# Altium project gateway-linux-cm4.PrjPcb
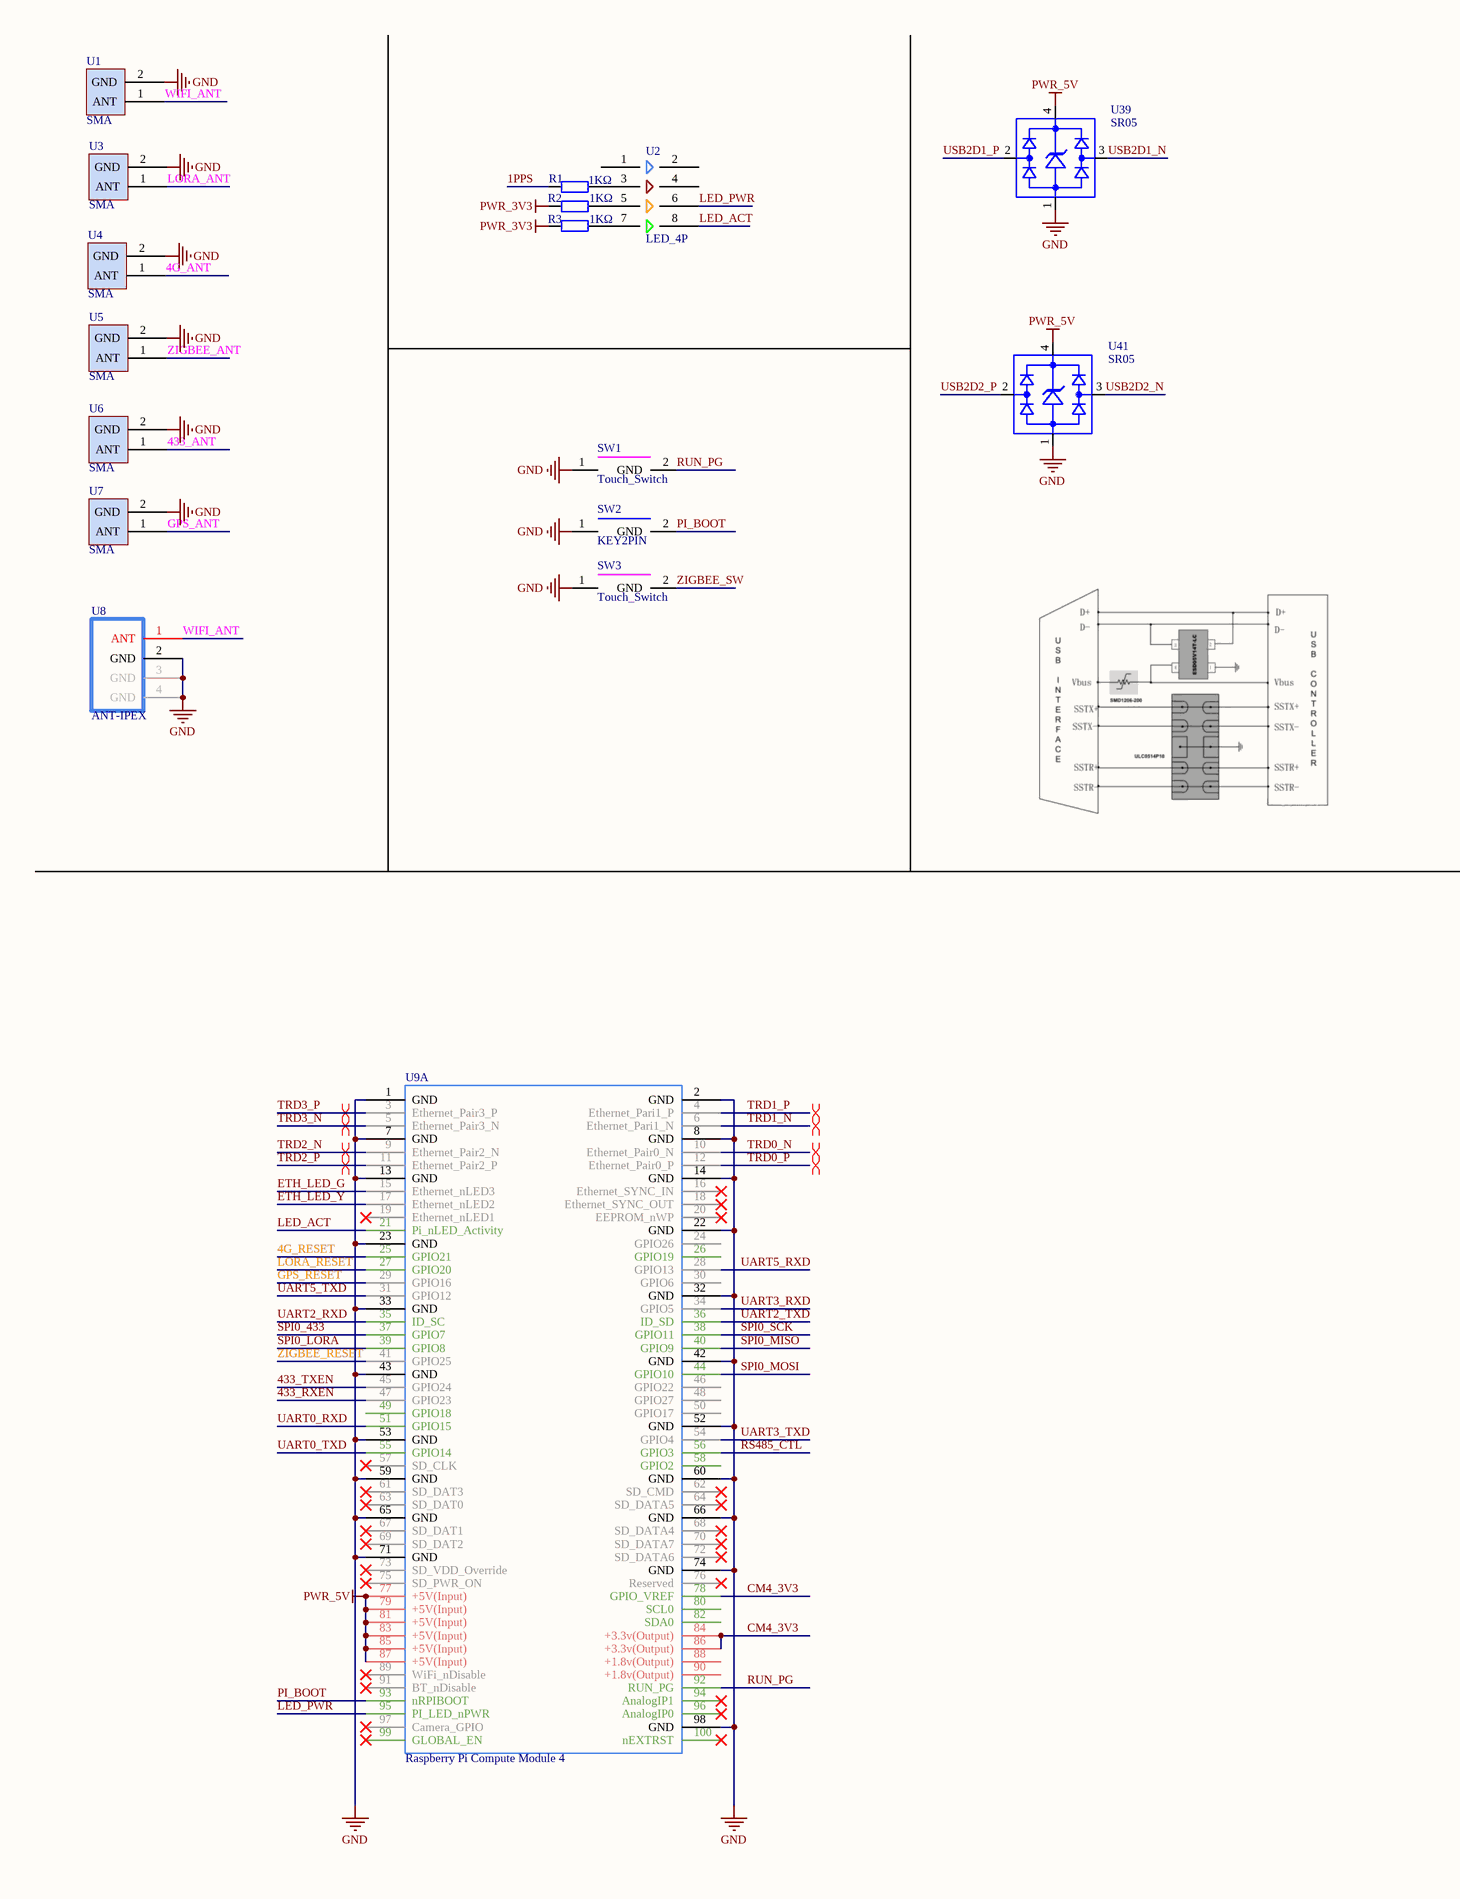
[diagram p0: G1-CM4.SchDoc, left]
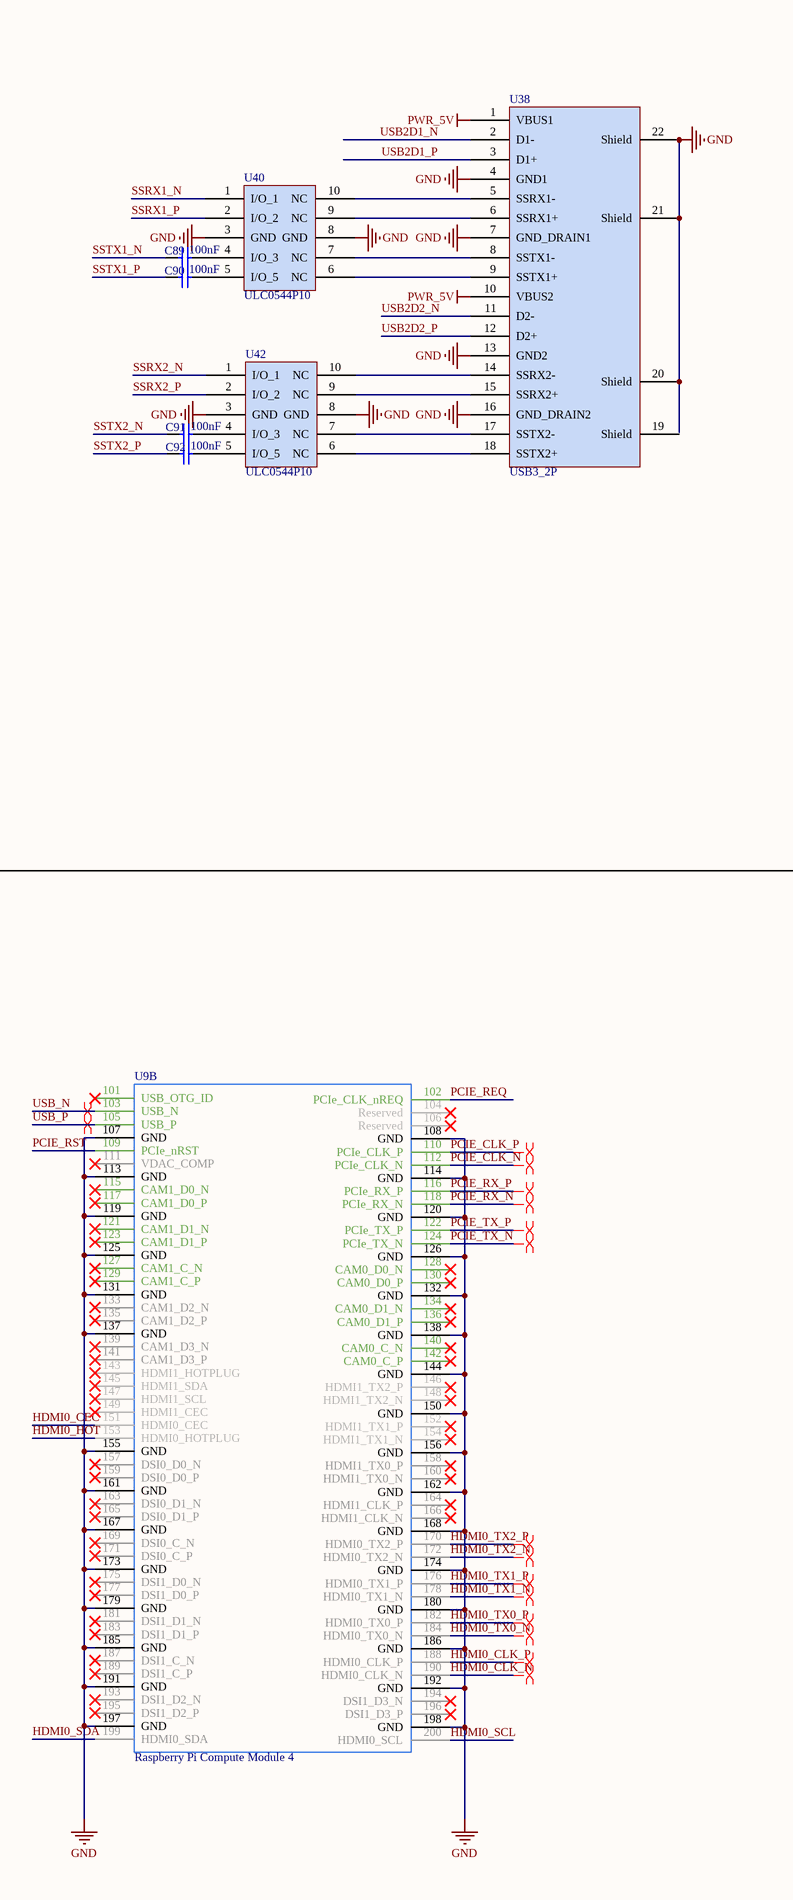
[diagram p1: G1-CM4.SchDoc, right]
3 sheets, 213 parts. Net scope: global (net labels, ports and power ports of the same name join across sheets).
Board file: G1.PcbDoc
Sheets:
  G1-CM4.SchDoc
  G2-PMS.SchDoc
  G3-Sensor.SchDoc

## Sheet G1-CM4.SchDoc
size A2; SheetNumber: 1; SheetTotal: 3

### Parts
C89  100nF  [0402_C]
C90  100nF  [0402_C]
C91  100nF  [0402_C]
C92  100nF  [0402_C]
R1  1KΩ  [0402_R]
R2  1KΩ  [0402_R]
R3  1KΩ  [0402_R]
SW1  Touch_Switch  [Touch_Switch]
SW2  KEY2PIN  [KEY2PIN]
SW3  Touch_Switch  [Touch_Switch]
U1  SMA  [SMA]
U2  LED_4P  [LED_4P]
U3  SMA  [SMA]
U4  SMA  [SMA]
U5  SMA  [SMA]
U6  SMA  [SMA]
U7  SMA  [SMA]
U8  ANT-IPEX  [ANT-IPEX]
U9  Raspberry Pi Compute Module 4  [CM4T-DF40HC(3.0)-100DS]  (parts A,B of 2)
U38  USB3_2P  [USB3_2P]
U39  SR05  [SR05]
U40  ULC0544P10  [ULC0544P10]
U41  SR05  [SR05]
U42  ULC0544P10  [ULC0544P10]

### Nets
GND: SW1.1 SW2.1 SW3.1 U1.2(GND) U3.2(GND) U4.2(GND) U5.2(GND) U6.2(GND) U7.2(GND) U8.2(GND) U8.3(GND) U8.4(GND) U9.1(GND) U9.2(GND) U9.7(GND) U9.8(GND) U9.13(GND) U9.14(GND) U9.22(GND) U9.23(GND) U9.32(GND) U9.33(GND) U9.42(GND) U9.43(GND) U9.52(GND) U9.53(GND) U9.59(GND) U9.60(GND) U9.65(GND) U9.66(GND) U9.71(GND) U9.74(GND) U9.98(GND) U9.107(GND) U9.108(GND) U9.113(GND) U9.114(GND) U9.119(GND) U9.120(GND) U9.125(GND) U9.126(GND) U9.131(GND) U9.132(GND) U9.137(GND) U9.138(GND) U9.144(GND) U9.150(GND) U9.155(GND) U9.156(GND) U9.161(GND) U9.162(GND) U9.167(GND) U9.168(GND) U9.173(GND) U9.174(GND) U9.179(GND) U9.180(GND) U9.185(GND) U9.186(GND) U9.191(GND) U9.192(GND) U9.197(GND) U9.198(GND) U38.4(GND1) U38.7(GND_DRAIN1) U38.13(GND2) U38.16(GND_DRAIN2) U38.20(Shield) U38.21(Shield) U38.22(Shield) U39.1 U40.3(GND) U40.8(GND) U41.1 U42.3(GND) U42.8(GND)
PWR_3V3: R2.1 R3.1
PWR_5V: U9.77(+5V(Input)) U9.79(+5V(Input)) U9.81(+5V(Input)) U9.83(+5V(Input)) U9.85(+5V(Input)) U9.87(+5V(Input)) U38.1(VBUS1) U38.10(VBUS2) U39.4 U41.4
1PPS: R1.1
4G_ANT: U4.1(ANT)
4G_RESET: U9.25(GPIO21)
433_ANT: U6.1(ANT)
433_RXEN: U9.47(GPIO23)
433_TXEN: U9.45(GPIO24)
CM4_3V3: U9.78(GPIO_VREF) U9.84(+3.3v(Output)) U9.86(+3.3v(Output))
ETH_LED_G: U9.15(Ethernet_nLED3)
ETH_LED_Y: U9.17(Ethernet_nLED2)
GPS_ANT: U7.1(ANT)
GPS_RESET: U9.29(GPIO16)
HDMI0_CEC: U9.151(HDMI0_CEC)
HDMI0_CLK_N: U9.190(HDMI0_CLK_N)
HDMI0_CLK_P: U9.188(HDMI0_CLK_P)
HDMI0_HOT: U9.153(HDMI0_HOTPLUG)
HDMI0_SCL: U9.200(HDMI0_SCL)
HDMI0_SDA: U9.199(HDMI0_SDA)
HDMI0_TX0_N: U9.184(HDMI0_TX0_N)
HDMI0_TX0_P: U9.182(HDMI0_TX0_P)
HDMI0_TX1_N: U9.178(HDMI0_TX1_N)
HDMI0_TX1_P: U9.176(HDMI0_TX1_P)
HDMI0_TX2_N: U9.172(HDMI0_TX2_N)
HDMI0_TX2_P: U9.170(HDMI0_TX2_P)
LED_ACT: U2.8 U9.21(Pi_nLED_Activity)
LED_PWR: U2.6 U9.95(PI_LED_nPWR)
LORA_ANT: U3.1(ANT)
LORA_RESET: U9.27(GPIO20)
PCIE_CLK_N: U9.112(PCIe_CLK_N)
PCIE_CLK_P: U9.110(PCIe_CLK_P)
PCIE_REQ: U9.102(PCIe_CLK_nREQ)
PCIE_RST: U9.109(PCIe_nRST)
PCIE_RX_N: U9.118(PCIe_RX_N)
PCIE_RX_P: U9.116(PCIe_RX_P)
PCIE_TX_N: U9.124(PCIe_TX_N)
PCIE_TX_P: U9.122(PCIe_TX_P)
PI_BOOT: SW2.2(GND) U9.93(nRPIBOOT)
RS485_CTL: U9.56(GPIO3)
RUN_PG: SW1.2(GND) U9.92(RUN_PG)
SPI0_433: U9.37(GPIO7)
SPI0_LORA: U9.39(GPIO8)
SPI0_MISO: U9.40(GPIO9)
SPI0_MOSI: U9.44(GPIO10)
SPI0_SCK: U9.38(GPIO11)
SSRX1_N: U40.1(I/O_1)
SSRX1_P: U40.2(I/O_2)
SSRX2_N: U42.1(I/O_1)
SSRX2_P: U42.2(I/O_2)
SSTX1_N: C89.1
SSTX1_P: C90.1
SSTX2_N: C91.1
SSTX2_P: C92.1
TRD0_N: U9.10(Ethernet_Pair0_N)
TRD0_P: U9.12(Ethernet_Pair0_P)
TRD1_N: U9.6(Ethernet_Pari1_N)
TRD1_P: U9.4(Ethernet_Pari1_P)
TRD2_N: U9.9(Ethernet_Pair2_N)
TRD2_P: U9.11(Ethernet_Pair2_P)
TRD3_N: U9.5(Ethernet_Pair3_N)
TRD3_P: U9.3(Ethernet_Pair3_P)
UART0_RXD: U9.51(GPIO15)
UART0_TXD: U9.55(GPIO14)
UART2_RXD: U9.35(ID_SC)
UART2_TXD: U9.36(ID_SD)
UART3_RXD: U9.34(GPIO5)
UART3_TXD: U9.54(GPIO4)
UART5_RXD: U9.28(GPIO13)
UART5_TXD: U9.31(GPIO12)
USB2D1_N: U38.2(D1-) U39.3
USB2D1_P: U38.3(D1+) U39.2
USB2D2_N: U38.11(D2-) U41.3
USB2D2_P: U38.12(D2+) U41.2
USB_N: U9.103(USB_N)
USB_P: U9.105(USB_P)
WIFI_ANT: U1.1(ANT) U8.1(ANT)
ZIGBEE_ANT: U5.1(ANT)
ZIGBEE_RESET: U9.41(GPIO25)
ZIGBEE_SW: SW3.2(GND)
NetC89_2: C89.2 U40.4(I/O_3)
NetC90_2: C90.2 U40.5(I/O_5)
NetC91_2: C91.2 U42.4(I/O_3)
NetC92_2: C92.2 U42.5(I/O_5)
NetR1_2: R1.2 U2.3
NetR2_2: R2.2 U2.5
NetR3_2: R3.2 U2.7
NetU38_5: U38.5(SSRX1-) U40.10(NC)
NetU38_6: U38.6(SSRX1+) U40.9(NC)
NetU38_8: U38.8(SSTX1-) U40.7(NC)
NetU38_9: U38.9(SSTX1+) U40.6(NC)
NetU38_14: U38.14(SSRX2-) U42.10(NC)
NetU38_15: U38.15(SSRX2+) U42.9(NC)
NetU38_17: U38.17(SSTX2-) U42.7(NC)
NetU38_18: U38.18(SSTX2+) U42.6(NC)

Not connected (* = marked no-connect by the designer): U2 1 2 4; U9 16(Ethernet_SYNC_IN)* 18(Ethernet_SYNC_OUT)* 19(Ethernet_nLED1)* 20(EEPROM_nWP)* 24(GPIO26) 26(GPIO19) 30(GPIO6) 46(GPIO22) 48(GPIO27) 49(GPIO18) 50(GPIO17) 57(SD_CLK)* 58(GPIO2) 61(SD_DAT3)* 62(SD_CMD)* 63(SD_DAT0)* 64(SD_DATA5)* 67(SD_DAT1)* 68(SD_DATA4)* 69(SD_DAT2)* 70(SD_DATA7)* 72(SD_DATA6)* 73(SD_VDD_Override)* 75(SD_PWR_ON)* 76(Reserved)* 80(SCL0) 82(SDA0) 88(+1.8v(Output)) 89(WiFi_nDisable)* 90(+1.8v(Output)) 91(BT_nDisable)* 94(AnalogIP1)* 96(AnalogIP0)* 97(Camera_GPIO)* 99(GLOBAL_EN)* 100(nEXTRST)* 101(USB_OTG_ID)* 104(Reserved)* 106(Reserved)* 111(VDAC_COMP)* 115(CAM1_D0_N)* 117(CAM1_D0_P)* 121(CAM1_D1_N)* 123(CAM1_D1_P)* 127(CAM1_C_N)* 128(CAM0_D0_N)* 129(CAM1_C_P)* 130(CAM0_D0_P)* 133(CAM1_D2_N)* 134(CAM0_D1_N)* 135(CAM1_D2_P)* 136(CAM0_D1_P)* 139(CAM1_D3_N)* 140(CAM0_C_N)* 141(CAM1_D3_P)* 142(CAM0_C_P)* 143(HDMI1_HOTPLUG)* 145(HDMI1_SDA)* 146(HDMI1_TX2_P)* 147(HDMI1_SCL)* 148(HDMI1_TX2_N)* 149(HDMI1_CEC)* 152(HDMI1_TX1_P)* 154(HDMI1_TX1_N)* 157(DSI0_D0_N)* 158(HDMI1_TX0_P)* 159(DSI0_D0_P)* 160(HDMI1_TX0_N)* 163(DSI0_D1_N)* 164(HDMI1_CLK_P)* 165(DSI0_D1_P)* 166(HDMI1_CLK_N)* 169(DSI0_C_N)* 171(DSI0_C_P)* 175(DSI1_D0_N)* 177(DSI1_D0_P)* 181(DSI1_D1_N)* 183(DSI1_D1_P)* 187(DSI1_C_N)* 189(DSI1_C_P)* 193(DSI1_D2_N)* 194(DSI1_D3_N)* 195(DSI1_D2_P)* 196(DSI1_D3_P)*; U38 19(Shield)

### Layout directives
differential pair: HDMI0_CLK_N, HDMI0_CLK_P, HDMI0_TX0_N, HDMI0_TX0_P, HDMI0_TX1_N, HDMI0_TX1_P, HDMI0_TX2_N, HDMI0_TX2_P, PCIE_CLK_N, PCIE_CLK_P, PCIE_RX_N, PCIE_RX_P, PCIE_TX_N, PCIE_TX_P, TRD0_N, TRD0_P, TRD1_N, TRD1_P, TRD2_N, TRD2_P, TRD3_N, TRD3_P, USB_N, USB_P

### Library data of the parts
C89-C92 = 0402 100nF (104) 10% 16V: 贴片电容; ComponentLink1Description: 供应商链接; ComponentLink1URL: http://www.szlcsc.com/product/details_1877.html; Package: 0402; Supplier: LC; SuppliersPartNumber: C1525
R1-R3 = 0402 1KΩ (1001) 1%: 贴片电阻; ComponentLink1Description: 供应商链接; ComponentLink1URL: http://www.szlcsc.com/product/details_12256.html; Package: 0402; Supplier: LC; SuppliersPartNumber: C11702
SW1 SW3 = Touch_Switch: Touch_Switch 2PIN
SW2 = KEY2PIN: Switch Button
U1 U3-U7 = SMA: SMA ANT
U2 = LED_4P: LED
U8 = ANT-IPEX: ANT
U9 = CM4
U38 = USB3_2P: USB3.0 2Ports
U40 U42 = ULC0544P10: ESD

## Sheet G2-PMS.SchDoc
size A2; SheetNumber: 2; SheetTotal: 3
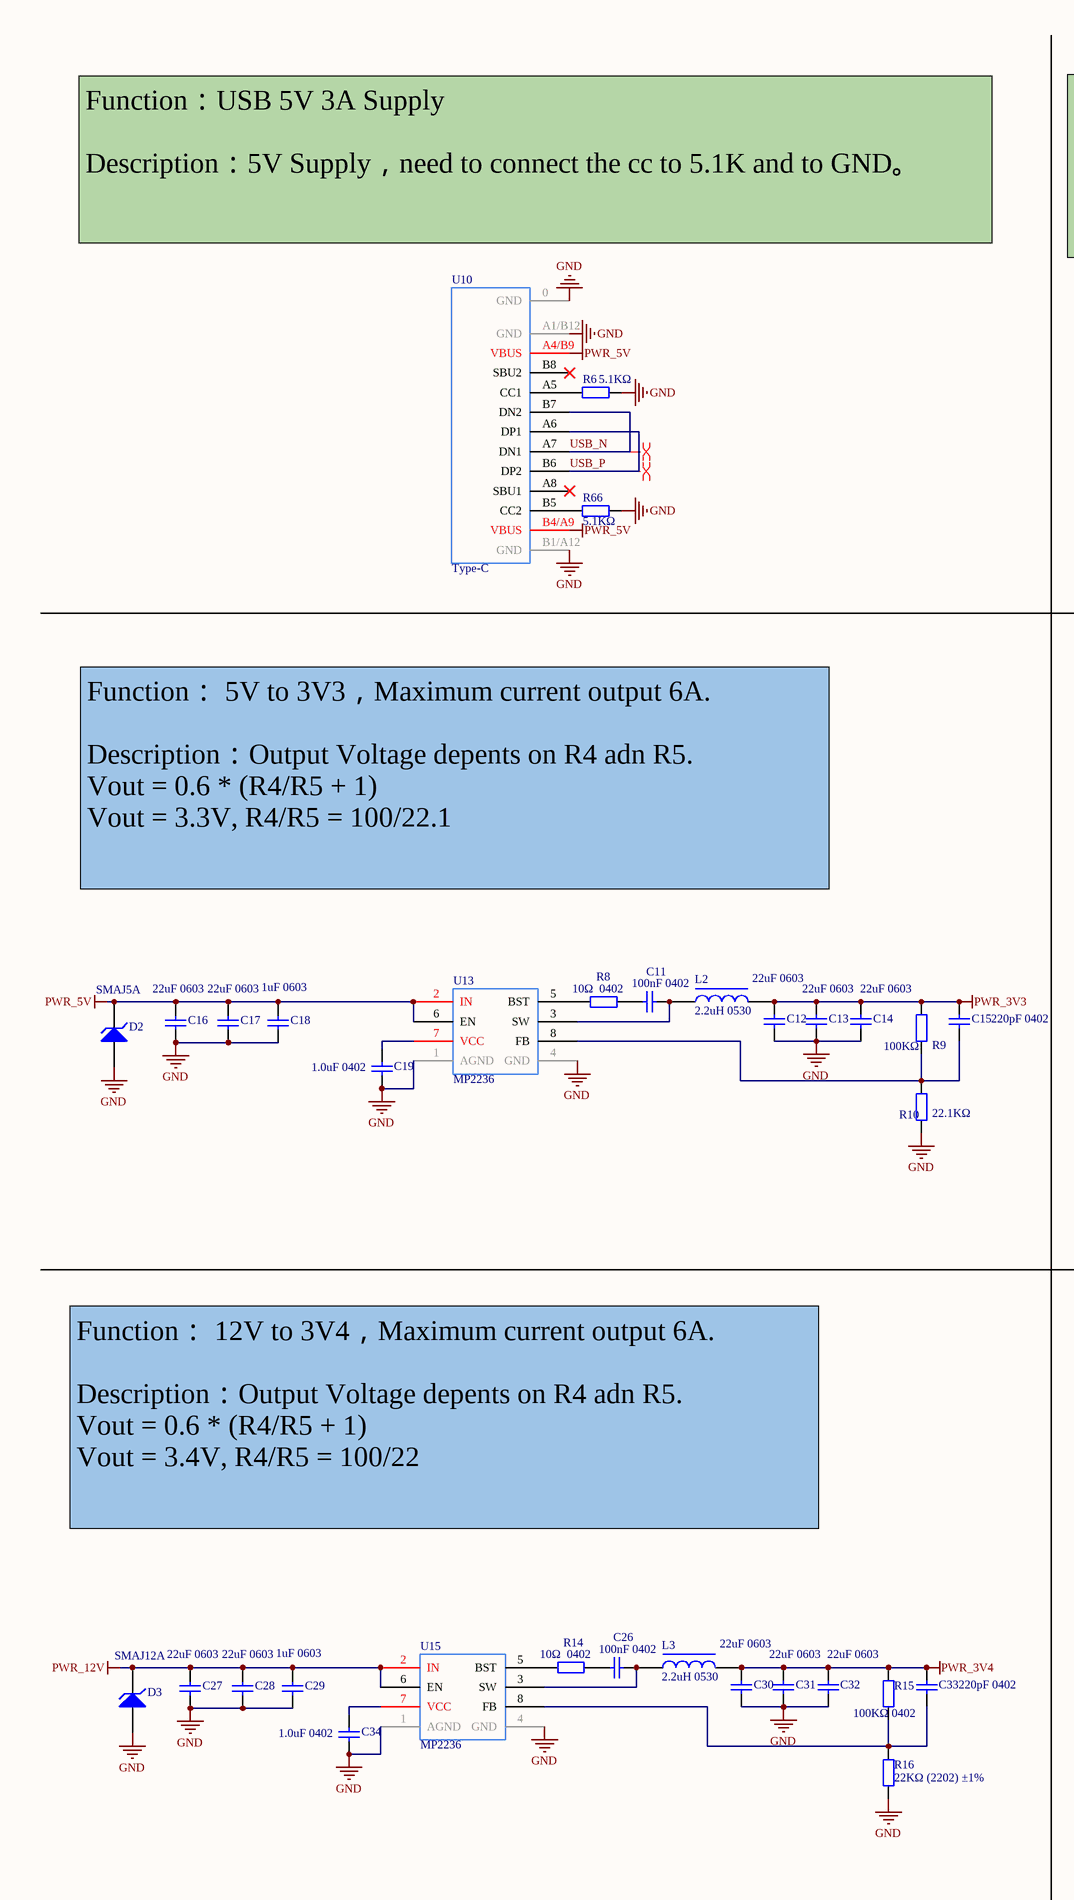
[diagram p2: G2-PMS.SchDoc, left]
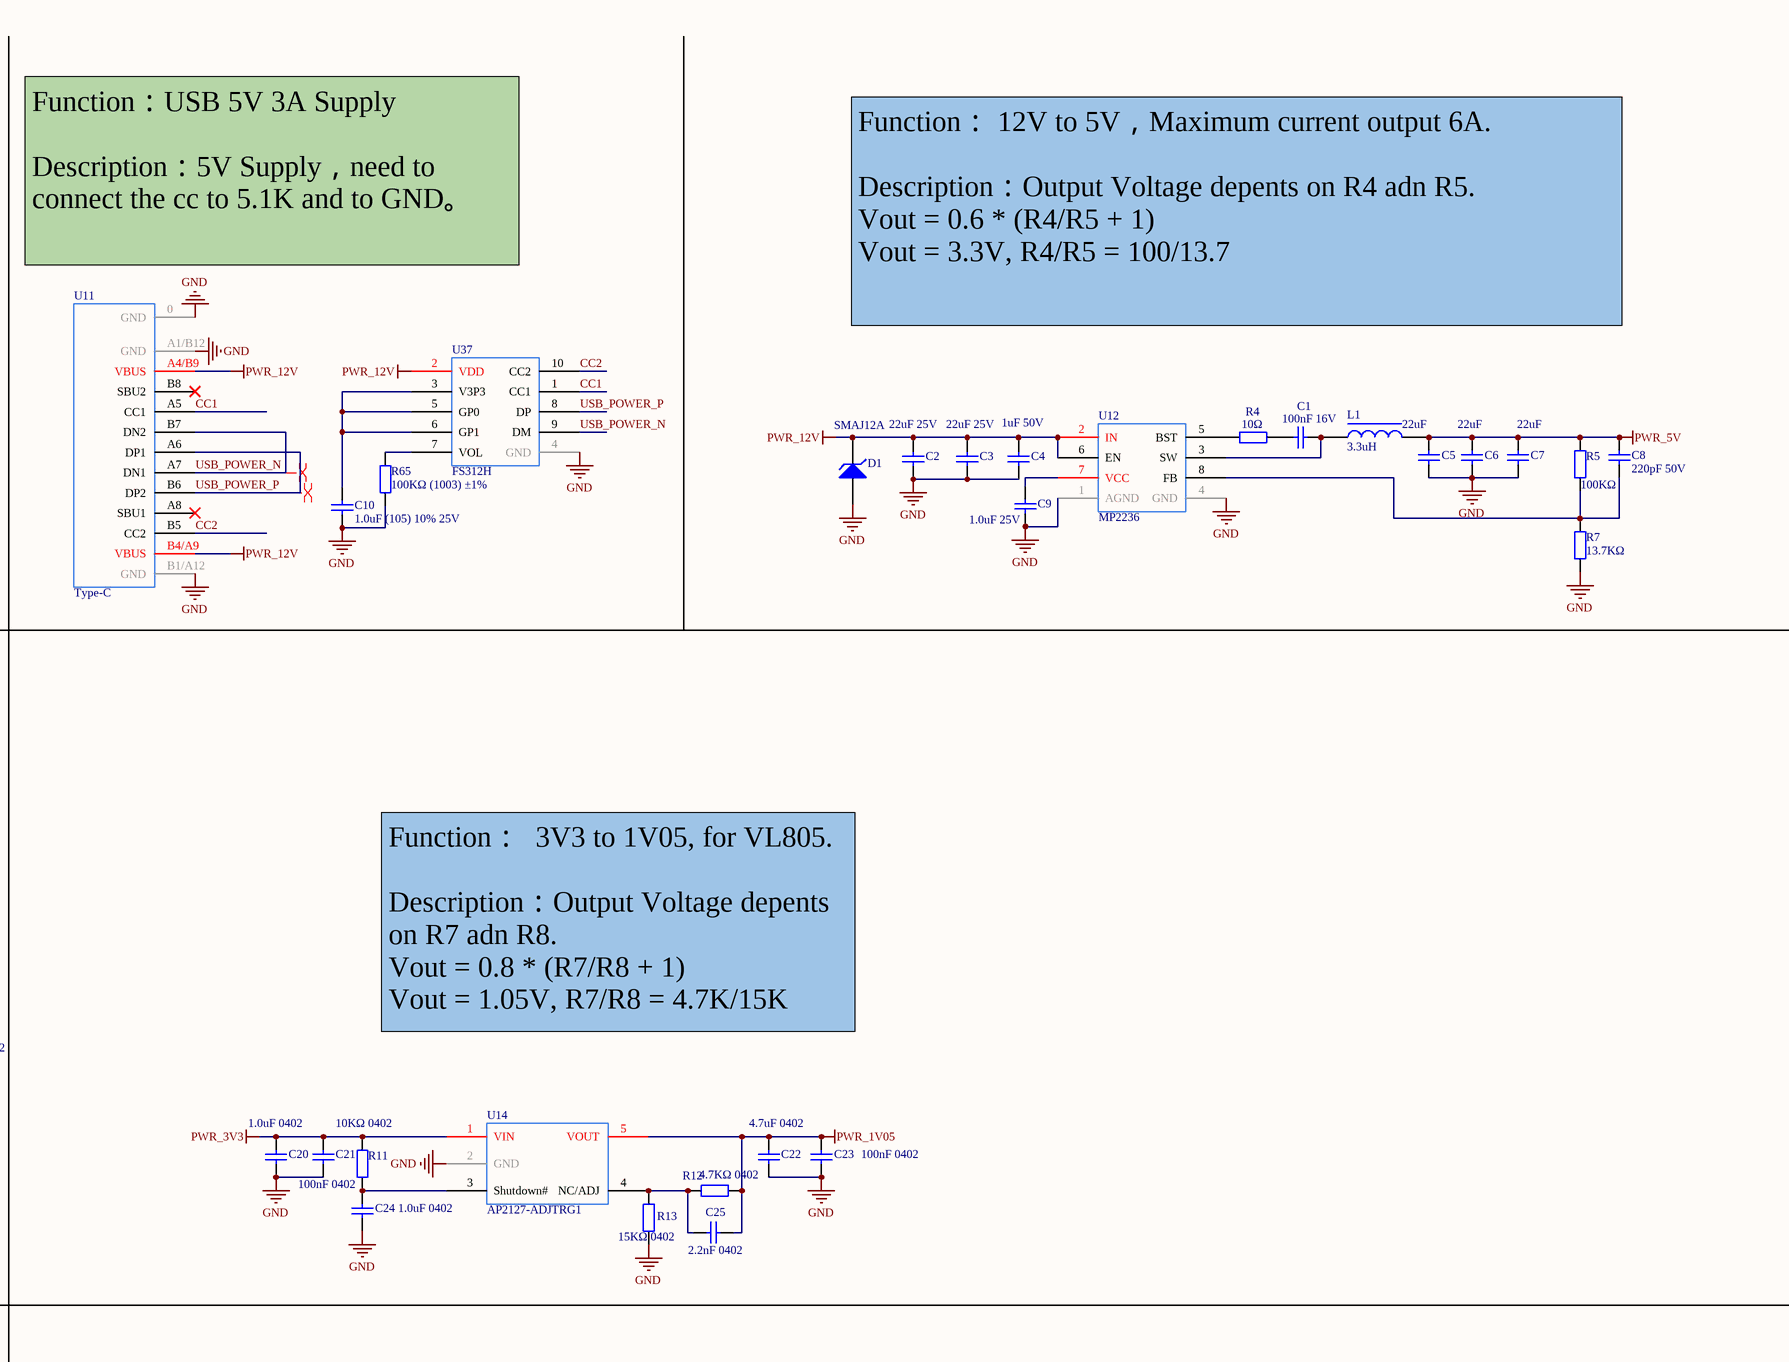
[diagram p3: G2-PMS.SchDoc, right]

### Parts
C1  100nF 16V  [0402_C]
C2  22uF 25V  [0805_C]
C3  22uF 25V  [0805_C]
C4  1uF 50V  [0805_C]
C5  22uF  [0805_C]
C6  22uF  [0805_C]
C7  22uF  [0805_C]
C8  220pF 50V  [0402_C]
C9  1.0uF 25V  [0402_C]
C10  1.0uF (105) 10% 25V  [0402_C]
C11  100nF 0402  [0402_C]
C12  22uF 0603  [0603_C]
C13  22uF 0603  [0603_C]
C14  22uF 0603  [0603_C]
C15  220pF 0402  [0402_C]
C16  22uF 0603  [0603_C]
C17  22uF 0603  [0603_C]
C18  1uF 0603  [0603_C]
C19  1.0uF 0402  [0402_C]
C20  1.0uF 0402  [0402_C]
C21  100nF 0402  [0402_C]
C22  4.7uF 0402  [0402_C]
C23  100nF 0402  [0402_C]
C24  1.0uF 0402  [0402_C]
C25  2.2nF 0402  [0402_C]
C26  100nF 0402  [0402_C]
C27  22uF 0603  [0603_C]
C28  22uF 0603  [0603_C]
C29  1uF 0603  [0603_C]
C30  22uF 0603  [0603_C]
C31  22uF 0603  [0603_C]
C32  22uF 0603  [0603_C]
C33  220pF 0402  [0402_C]
C34  1.0uF 0402  [0402_C]
D1  SMAJ12A  [SMAJ12A]
D2  SMAJ5A  [SMAJ12A]
D3  SMAJ12A  [SMAJ12A]
L1  3.3uH  [0530]
L2  2.2uH 0530  [0530]
L3  2.2uH 0530  [0530]
R4  10Ω  [0402_R]
R5  100KΩ  [0402_R]
R6  5.1KΩ  [0402_R]
R7  13.7KΩ  [0402_R]
R8  10Ω  0402  [0402_R]
R9  100KΩ  [0402_R]
R10  22.1KΩ  [0402_R]
R11  10KΩ 0402  [0402_R]
R12  4.7KΩ 0402  [0402_R]
R13  15KΩ 0402  [0402_R]
R14  10Ω  0402  [0402_R]
R15  100KΩ 0402  [0402_R]
R16  22KΩ (2202) ±1%  [0402_R]
R65  100KΩ (1003) ±1%  [0402_R]
R66  5.1KΩ  [0402_R]
U10  Type-C  [Type-C-16P]
U11  Type-C  [Type-C-16P]
U12  MP2236  [MP2236]
U13  MP2236  [MP2236]
U14  AP2127-ADJTRG1  [AP2127K]
U15  MP2236  [MP2236]
U37  FS312H  [FS312H]

### Nets
GND: C2.1 C3.1 C4.1 C5.1 C6.1 C7.1 C9.1 C10.1 C12.1 C13.1 C14.1 C16.1 C17.1 C18.1 C19.1 C20.1 C21.1 C22.1 C23.1 C24.1 C27.1 C28.1 C29.1 C30.1 C31.1 C32.1 C34.1 D1.1(A) D2.1(A) D3.1(A) R6.2 R7.1 R10.1 R13.1 R16.1 R65.1 R66.2 U10.0(GND) U10.A1/B12(GND) U10.B1/A12(GND) U11.0(GND) U11.A1/B12(GND) U11.B1/A12(GND) U12.1(AGND) U12.4(GND) U13.1(AGND) U13.4(GND) U14.2(GND) U15.1(AGND) U15.4(GND) U37.4(GND)
PWR_1V05: C22.2 C23.2 C25.2 R12.2 U14.5(VOUT)
PWR_3V3: C12.2 C13.2 C14.2 C15.2 C20.2 C21.2 L2.2 R9.2 R11.2 U14.1(VIN)
PWR_3V4: C30.2 C31.2 C32.2 C33.2 L3.2 R15.2
PWR_5V: C5.2 C6.2 C7.2 C8.2 C16.2 C17.2 C18.2 D2.2(C) L1.2 R5.2 U10.A4/B9(VBUS) U10.B4/A9(VBUS) U13.2(IN) U13.6(EN)
PWR_12V: C2.2 C3.2 C4.2 C27.2 C28.2 C29.2 D1.2(C) D3.2(C) U11.A4/B9(VBUS) U11.B4/A9(VBUS) U12.2(IN) U12.6(EN) U15.2(IN) U15.6(EN) U37.2(VDD)
CC1: U11.A5(CC1) U37.1(CC1)
CC2: U11.B5(CC2) U37.10(CC2)
USB_N: U10.A7(DN1) U10.B7(DN2)
USB_P: U10.A6(DP1) U10.B6(DP2)
USB_POWER_N: U11.A7(DN1) U11.B7(DN2) U37.9(DM)
USB_POWER_P: U11.A6(DP1) U11.B6(DP2) U37.8(DP)
NetC1_1: C1.1 R4.2
NetC1_2: C1.2 L1.1 U12.3(SW)
NetC8_1: C8.1 R5.1 R7.2 U12.8(FB)
NetC9_2: C9.2 U12.7(VCC)
NetC10_2: C10.2 U37.3(V3P3) U37.5(GP0) U37.6(GP1)
NetC11_1: C11.1 R8.2
NetC11_2: C11.2 L2.1 U13.3(SW)
NetC15_1: C15.1 R9.1 R10.2 U13.8(FB)
NetC19_2: C19.2 U13.7(VCC)
NetC24_2: C24.2 R11.1 U14.3(Shutdown#)
NetC25_1: C25.1 R12.1 R13.2 U14.4(NC/ADJ)
NetC26_1: C26.1 R14.2
NetC26_2: C26.2 L3.1 U15.3(SW)
NetC33_1: C33.1 R15.1 R16.2 U15.8(FB)
NetC34_2: C34.2 U15.7(VCC)
NetR4_1: R4.1 U12.5(BST)
NetR6_1: R6.1 U10.A5(CC1)
NetR8_1: R8.1 U13.5(BST)
NetR14_1: R14.1 U15.5(BST)
NetR65_2: R65.2 U37.7(VOL)
NetR66_1: R66.1 U10.B5(CC2)

Not connected (* = marked no-connect by the designer): U10 A8(SBU1)* B8(SBU2)*; U11 A8(SBU1)* B8(SBU2)*

### Layout directives
differential pair: USB_N, USB_P, USB_POWER_N, USB_POWER_P

### Notes on the sheet
- Function：USB 5V 3A Supply
  Description：5V Supply，need to connect the cc to 5.1K and to GND。
- (near U11) Function：USB 5V 3A Supply
  Description：5V Supply，need to connect the cc to 5.1K and to GND。
- Function： 12V to 5V，Maximum current output 6A.
  Description：Output Voltage depents on R4 adn R5.
  Vout = 0.6 * (R4/R5 + 1)
  Vout = 3.3V, R4/R5 = 100/13.7
- Function： 5V to 3V3，Maximum current output 6A.
  Description：Output Voltage depents on R4 adn R5.
  Vout = 0.6 * (R4/R5 + 1)
  Vout = 3.3V, R4/R5 = 100/22.1
- Function：  3V3 to 1V05, for VL805.
  Description：Output Voltage depents on R7 adn R8.
  Vout = 0.8 * (R7/R8 + 1)
  Vout = 1.05V, R7/R8 = 4.7K/15K
- Function： 12V to 3V4，Maximum current output 6A.
  Description：Output Voltage depents on R4 adn R5.
  Vout = 0.6 * (R4/R5 + 1)
  Vout = 3.4V, R4/R5 = 100/22

### Library data of the parts
C1 C11 C21 C23 C26 = 0402 100nF (104) 10% 16V: 贴片电容; ComponentLink1Description: 供应商链接; ComponentLink1URL: http://www.szlcsc.com/product/details_1877.html; Package: 0402; Supplier: LC; SuppliersPartNumber: C1525
C2 C3 C5-C7 = 0805 22uF (226) 20% 25V: 贴片电容; ComponentLink1Description: 供应商链接; ComponentLink1URL: http://www.szlcsc.com/product/details_46786.html; Package: 0805; Supplier: LC; SuppliersPartNumber: C45783
C4 = 0805 1uF (105) 10% 50V: 贴片电容; ComponentLink1Description: 供应商链接; ComponentLink1URL: http://www.szlcsc.com/product/details_29074.html; Package: 0805; Supplier: LC; SuppliersPartNumber: C28323
C8 C15 C33 = 0402 220pF (221) 10% 50V: 贴片电容; ComponentLink1Description: 供应商链接; ComponentLink1URL: http://www.szlcsc.com/product/details_1882.html; Package: 0402; Supplier: LC; SuppliersPartNumber: C1530
C9 C10 C19 C20 C24 C34 = 0402 1.0uF (105) 10% 25V: 贴片电容; ComponentLink1Description: 供应商链接; ComponentLink1URL: http://www.szlcsc.com/product/details_53938.html; Package: 0402; Supplier: LC; SuppliersPartNumber: C52923
C12-C14 C16 C17 C27 C28 C30-C32 = 0603 22uF (226) 20% 6.3V: 贴片电容; ComponentLink1Description: 供应商链接; ComponentLink1URL: http://www.szlcsc.com/product/details_60514.html; Package: 0603; Supplier: LC; SuppliersPartNumber: C59461
C18 C29 = 0603 1uF (105) 10% 50V: 贴片电容; ComponentLink1Description: 供应商链接; ComponentLink1URL: http://www.szlcsc.com/product/details_16531.html; Package: 0603; Supplier: LC; SuppliersPartNumber: C15849
C22 = 0402 4.7uF (475) 20% 10V: 贴片电容; ComponentLink1Description: 供应商链接; ComponentLink1URL: http://www.szlcsc.com/product/details_24469.html; Package: 0402; Supplier: LC; SuppliersPartNumber: C23733
C25 = 0402 2.2nF (222) 10% 50V: 贴片电容; ComponentLink1Description: 供应商链接; ComponentLink1URL: http://www.szlcsc.com/product/details_1883.html; Package: 0402; Supplier: LC; SuppliersPartNumber: C1531
D1-D3 = SMAJ12A: TVS
L1 = 3.3uH: 3.3uH 0630
L2 L3 = 2.2uH: 2.2uH 0630
R4 R8 R14 = 0402 10Ω (10R0) 1%: 贴片电阻; ComponentLink1Description: 供应商链接; ComponentLink1URL: http://www.szlcsc.com/product/details_25820.html; Package: 0402; Supplier: LC; SuppliersPartNumber: C25077
R5 R9 R15 R65 = 0402 100KΩ (1003) 1%: 贴片电阻; ComponentLink1Description: 供应商链接; ComponentLink1URL: http://www.szlcsc.com/product/details_26484.html; Package: 0402; Supplier: LC; SuppliersPartNumber: C25741
R6 R66 = 0402 5.1KΩ (5101) 1%: 贴片电阻; ComponentLink1Description: 供应商链接; ComponentLink1URL: http://www.szlcsc.com/product/details_26648.html; Package: 0402; Supplier: LC; SuppliersPartNumber: C25905
R7 R10 R11 = 0402 10KΩ (1002) 1%: 贴片电阻; ComponentLink1Description: 供应商链接; ComponentLink1URL: http://www.szlcsc.com/product/details_26487.html; Package: 0402; Supplier: LC; SuppliersPartNumber: C25744
R12 = 0402 4.7KΩ (4701) 1%: 贴片电阻; ComponentLink1Description: 供应商链接; ComponentLink1URL: http://www.szlcsc.com/product/details_26643.html; Package: 0402; Supplier: LC; SuppliersPartNumber: C25900
R13 = 0402 15KΩ (1502) 1%: 贴片电阻; ComponentLink1Description: 供应商链接; ComponentLink1URL: http://www.szlcsc.com/product/details_26499.html; Package: 0402; Supplier: LC; SuppliersPartNumber: C25756
R16 = 0402 22KΩ (2202) 1%: 贴片电阻; ComponentLink1Description: 供应商链接; ComponentLink1URL: http://www.szlcsc.com/product/details_26511.html; Package: 0402; Supplier: LC; SuppliersPartNumber: C25768
U10 U11 = Type-C-16P
U12 U13 U15 = MP2236: Vin=18, Iout=6A
U14 = AP2127-ADJTRG1: 3.3V-1.05V
U37 = FS312H: USB POWER PD 20V

## Sheet G3-Sensor.SchDoc
size A2; SheetNumber: 3; SheetTotal: 3
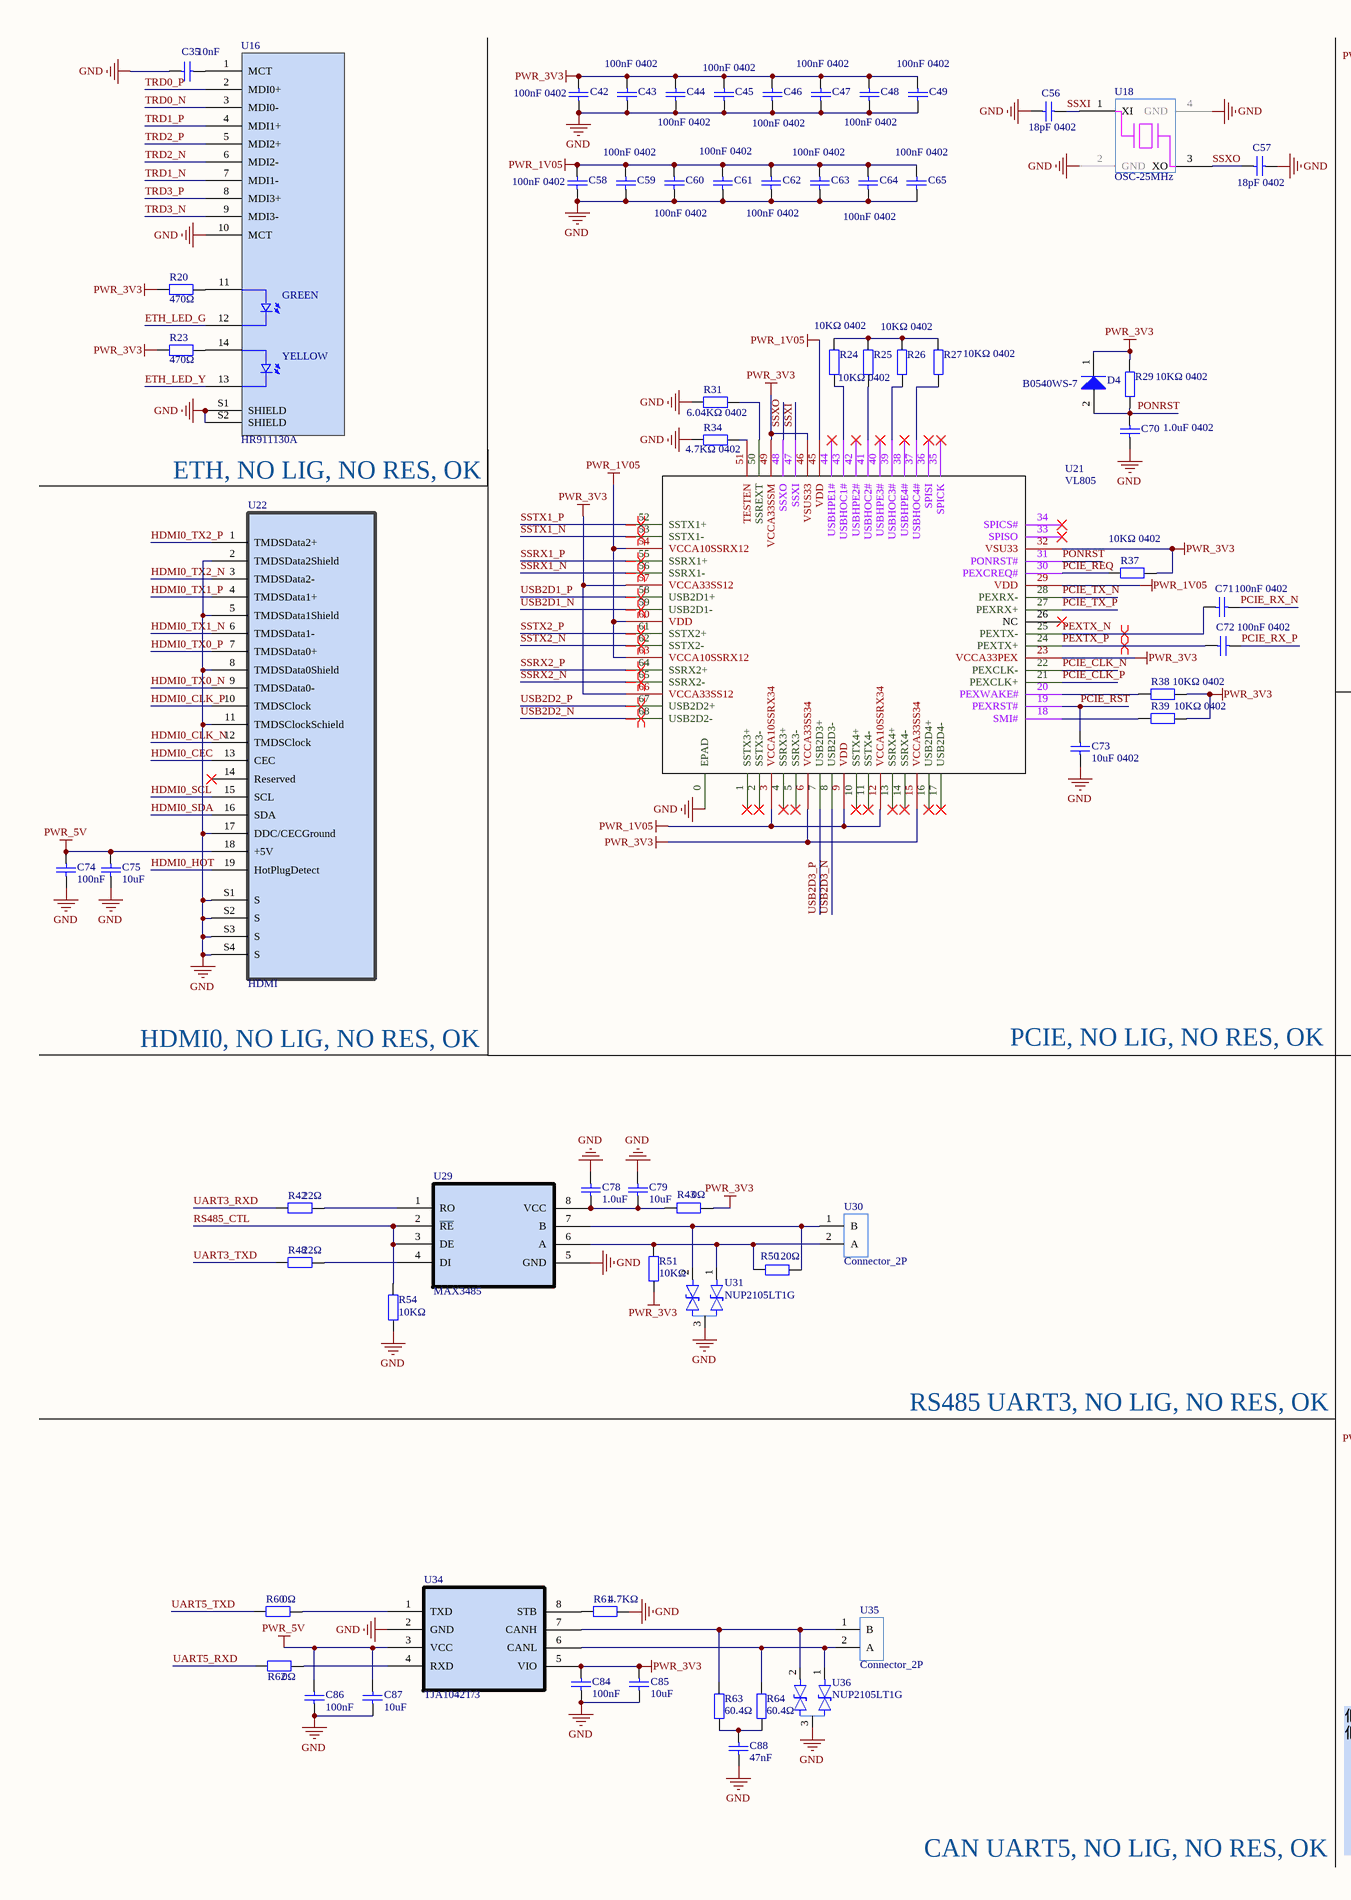
[diagram p4: G3-Sensor.SchDoc, left]
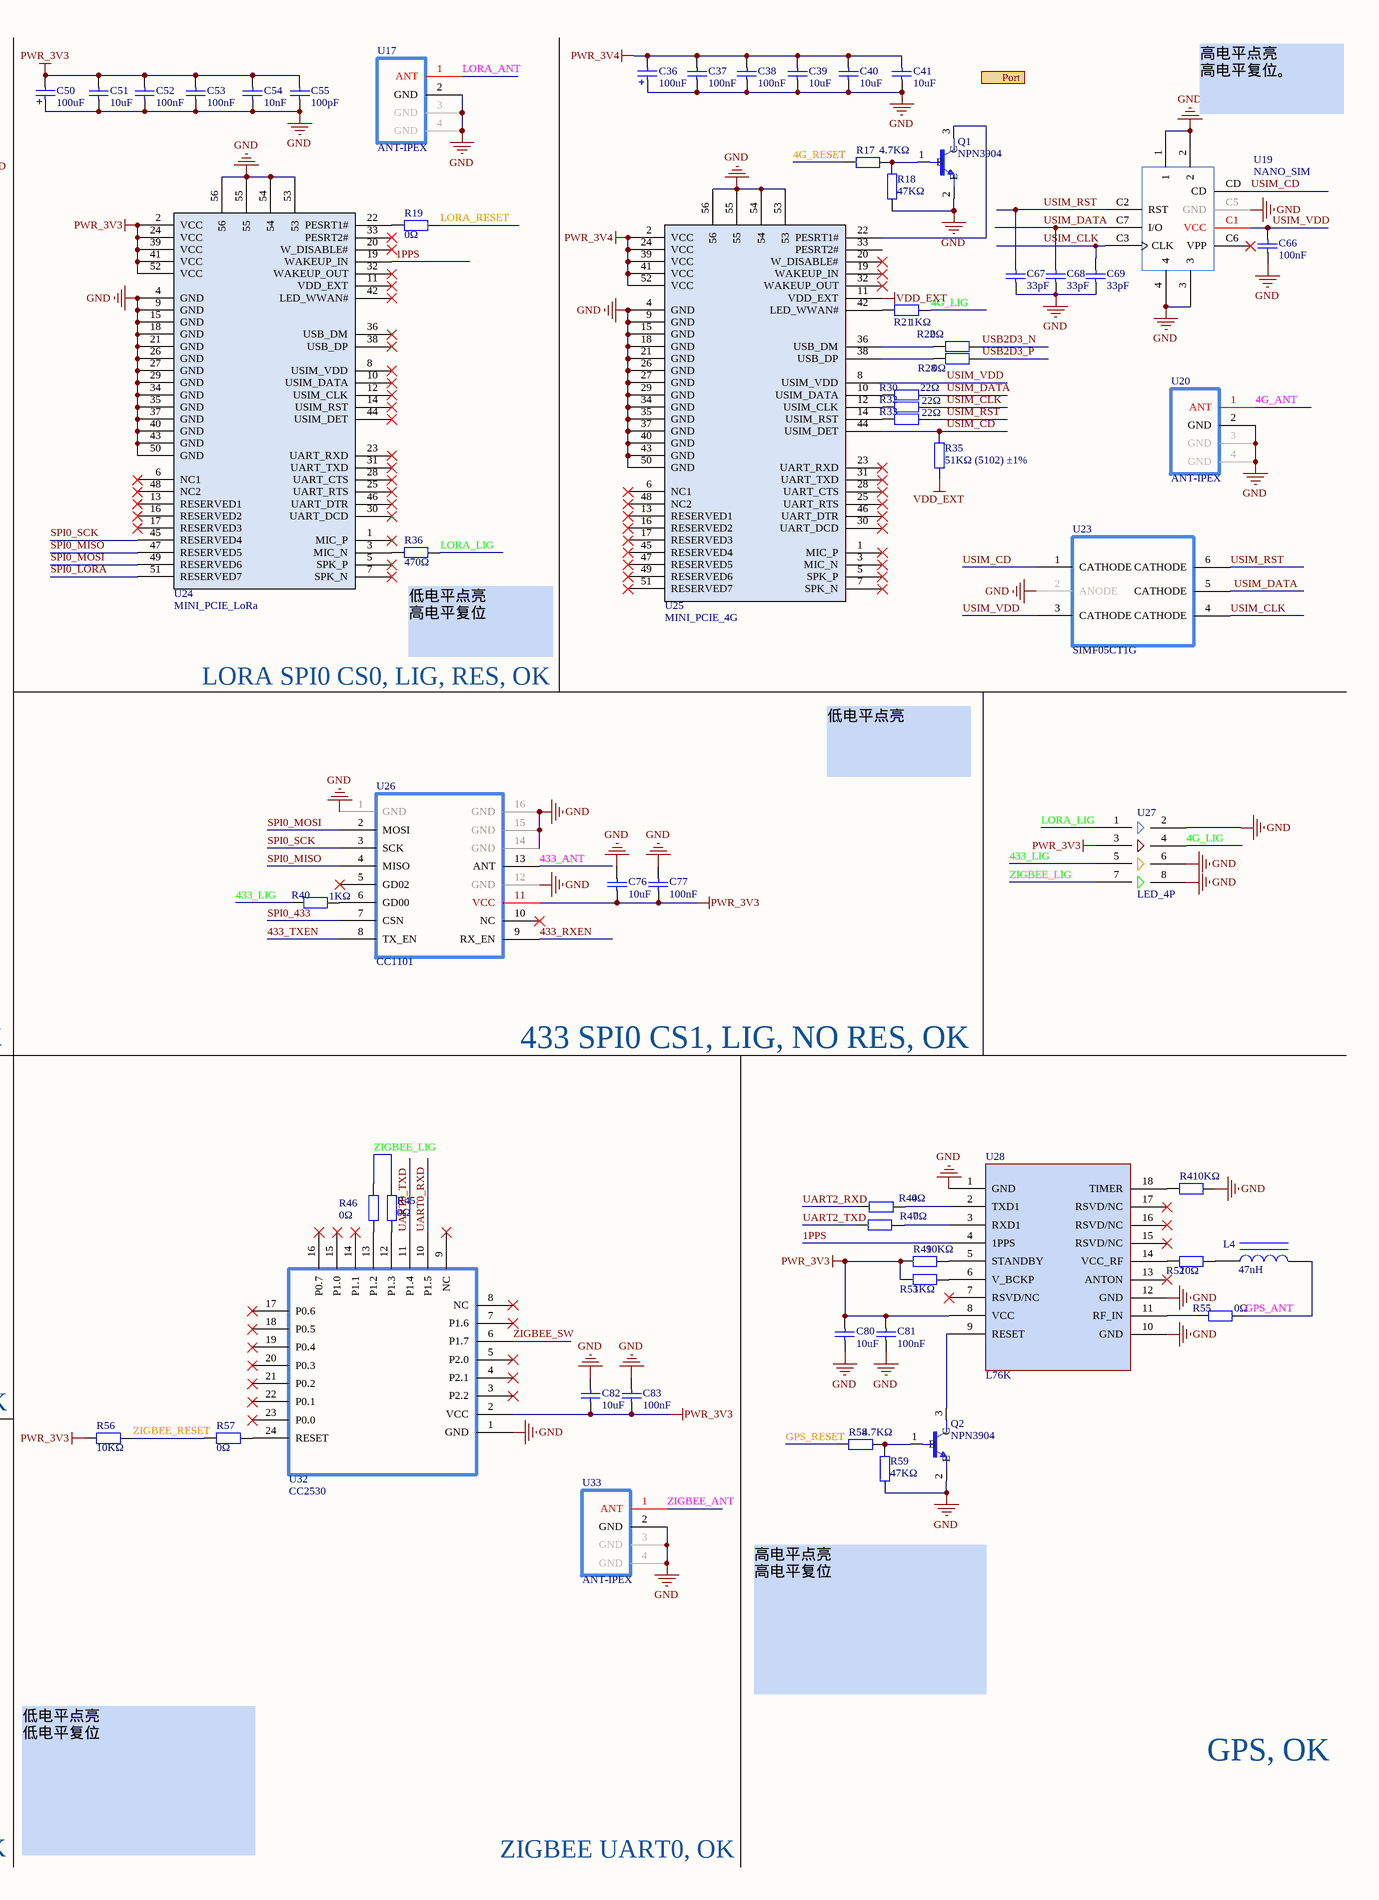
[diagram p5: G3-Sensor.SchDoc, right]

### Parts
C35  10nF  [0402_C]
C36  100uF  [CASE-B_3528]
C37  100nF  [1206_C]
C38  100nF  [1206_C]
C39  10uF  [1206_C]
C40  10uF  [1206_C]
C41  10uF  [1206_C]
C42  100nF 0402  [0402_C]
C43  100nF 0402  [0402_C]
C44  100nF 0402  [0402_C]
C45  100nF 0402  [0402_C]
C46  100nF 0402  [0402_C]
C47  100nF 0402  [0402_C]
C48  100nF 0402  [0402_C]
C49  100nF 0402  [0402_C]
C50  100uF  [CASE-B_3528]
C51  10uF  [0402_C]
C52  100nF  [0402_C]
C53  100nF  [0402_C]
C54  10nF  [0402_C]
C55  100pF  [0402_C]
C56  18pF 0402  [0402_C]
C57  18pF 0402  [0402_C]
C58  100nF 0402  [0402_C]
C59  100nF 0402  [0402_C]
C60  100nF 0402  [0402_C]
C61  100nF 0402  [0402_C]
C62  100nF 0402  [0402_C]
C63  100nF 0402  [0402_C]
C64  100nF 0402  [0402_C]
C65  100nF 0402  [0402_C]
C66  100nF  [0402_C]
C67  33pF  [0402_C]
C68  33pF  [0402_C]
C69  33pF  [0402_C]
C70  1.0uF 0402  [0402_C]
C71  100nF 0402  [0402_C]
C72  100nF 0402  [0402_C]
C73  10uF 0402  [0402_C]
C74  100nF  [0402_C]
C75  10uF  [0402_C]
C76  10uF  [0402_C]
C77  100nF  [0402_C]
C78  1.0uF  [0402_C]
C79  10uF  [0402_C]
C80  10uF  [0402_C]
C81  100nF  [0402_C]
C82  10uF  [0402_C]
C83  100nF  [0402_C]
C84  100nF  [0402_C]
C85  10uF  [0402_C]
C86  100nF  [0402_C]
C87  10uF  [0402_C]
C88  47nF  [0402_C]
D4  B0540WS-7  [B0540WS-7]
L4  47nH  [0603_L]
Q1  NPN3904  [NPN3904]
Q2  NPN3904  [NPN3904]
R17  4.7KΩ  [0402_R]
R18  47KΩ  [0402_R]
R19  0Ω  [0402_R]
R20  470Ω  [0402_R]
R21  1KΩ  [0402_R]
R22  0Ω  [0402_R]
R23  470Ω  [0402_R]
R24  10KΩ 0402  [0402_R]
R25  10KΩ 0402  [0402_R]
R26  10KΩ 0402  [0402_R]
R27  10KΩ 0402  [0402_R]
R28  0Ω  [0402_R]
R29  10KΩ 0402  [0402_R]
R30  22Ω  [0402_R]
R31  6.04KΩ 0402  [0402_R]
R32  22Ω  [0402_R]
R33  22Ω  [0402_R]
R34  4.7KΩ 0402  [0402_R]
R35  51KΩ (5102) ±1%  [0402_R]
R36  470Ω  [0402_R]
R37  10KΩ 0402  [0402_R]
R38  10KΩ 0402  [0402_R]
R39  10KΩ 0402  [0402_R]
R40  1KΩ  [0402_R]
R41  10KΩ  [0402_R]
R42  22Ω  [0402_R]
R43  0Ω  [0402_R]
R44  0Ω  [0402_R]
R45  0Ω  [0402_R]
R46  0Ω  [0402_R]
R47  0Ω  [0402_R]
R48  22Ω  [0402_R]
R49  10KΩ  [0402_R]
R50  120Ω  [0402_R]
R51  10KΩ  [0402_R]
R52  10Ω  [0402_R]
R53  1KΩ  [0402_R]
R54  10KΩ  [0402_R]
R55  0Ω  [0402_R]
R56  10KΩ  [0402_R]
R57  0Ω  [0402_R]
R58  4.7KΩ  [0402_R]
R59  47KΩ  [0402_R]
R60  0Ω  [0402_R]
R61  4.7KΩ  [0402_R]
R62  0Ω  [0402_R]
R63  60.4Ω  [0402_R]
R64  60.4Ω  [0402_R]
U16  HR911130A  [HR911130A]
U17  ANT-IPEX  [ANT-IPEX]
U18  OSC-25MHz  [OSC-25MHz]
U19  NANO_SIM  [NANO_SIM]
U20  ANT-IPEX  [ANT-IPEX]
U21  VL805  [VL805]
U22  HDMI  [HDMI]
U23  SIMF05CT1G  [SMF05CT1G]
U24  MINI_PCIE_LoRa  [MINI-PCIE]
U25  MINI_PCIE_4G  [MINI-PCIE]
U26  CC1101  [CC1101]
U27  LED_4P  [LED_4P]
U28  L76K  [L76K]
U29  MAX3485  [MAX3485]
U30  Connector_2P  [CONNECTOR_2P]
U31  NUP2105LT1G  [NUP2105LT1G]
U32  CC2530  [CC2530]
U33  ANT-IPEX  [ANT-IPEX]
U34  TJA1042T/3  [TJA1042T]
U35  Connector_2P  [CONNECTOR_2P]
U36  NUP2105LT1G  [NUP2105LT1G]

### Ports
Port

### Nets
GND: C35.1 C36.1 C37.1 C38.1 C39.1 C40.1 C41.1 C42.1 C43.1 C44.1 C45.1 C46.1 C47.1 C48.1 C49.1 C50.1 C51.1 C52.1 C53.1 C54.1 C55.1 C56.1 C57.2 C58.1 C59.1 C60.1 C61.1 C62.1 C63.1 C64.1 C65.1 C66.1 C67.1 C68.1 C69.1 C70.2 C73.1 C74.1 C75.1 C76.2 C77.2 C78.2 C79.2 C80.1 C81.1 C82.2 C83.2 C84.1 C85.1 C86.1 C87.1 C88.1 Q1.2(E) Q2.2(E) R18.1 R31.2 R34.2 R41.2 R54.1 R59.1 R61.2 U16.10(MCT) U16.S1(SHIELD) U16.S2(SHIELD) U17.2(GND) U17.3(GND) U17.4(GND) U18.2(GND) U18.4(GND) U19.1 U19.2 U19.3 U19.4 U19.C5(GND) U20.2(GND) U20.3(GND) U20.4(GND) U21.0(EPAD) U22.2(TMDSData2Shield) U22.5(TMDSData1Shield) U22.8(TMDSData0Shield) U22.11(TMDSClockSchield) U22.17(DDC/CECGround) U22.S1(S) U22.S2(S) U22.S3(S) U22.S4(S) U23.2(ANODE) U24.4(GND) U24.9(GND) U24.15(GND) U24.18(GND) U24.21(GND) U24.26(GND) U24.27(GND) U24.29(GND) U24.34(GND) U24.35(GND) U24.37(GND) U24.40(GND) U24.43(GND) U24.50(GND) U24.53 U24.54 U24.55 U24.56 U25.4(GND) U25.9(GND) U25.15(GND) U25.18(GND) U25.21(GND) U25.26(GND) U25.27(GND) U25.29(GND) U25.34(GND) U25.35(GND) U25.37(GND) U25.40(GND) U25.43(GND) U25.50(GND) U25.53 U25.54 U25.55 U25.56 U26.1(GND) U26.12(GND) U26.14(GND) U26.15(GND) U26.16(GND) U27.2 U27.6 U27.8 U28.1(GND) U28.10(GND) U28.12(GND) U29.5(GND) U31.3 U32.1(GND) U33.2(GND) U33.3(GND) U33.4(GND) U34.2(GND) U36.3
PWR_1V05: C58.2 C59.2 C60.2 C61.2 C62.2 C63.2 C64.2 C65.2 U21.3(VCCA10SSRX34) U21.9(VDD) U21.12(VCCA10SSRX34) U21.29(VDD) U21.45(VDD) U21.54(VCCA10SSRX12) U21.60(VDD) U21.63(VCCA10SSRX12)
PWR_3V3: C42.2 C43.2 C44.2 C45.2 C46.2 C47.2 C48.2 C49.2 C50.2 C51.2 C52.2 C53.2 C54.2 C55.2 C76.1 C77.1 C80.2 C81.2 C82.1 C83.1 C84.2 C85.2 D4.1(K) R20.1 R23.1 R29.2 R37.2 R38.2 R39.2 R43.2 R49.1 R51.1 R53.1 R56.1 U21.6(VCCA33SS34) U21.15(VCCA33SS34) U21.23(VCCA33PEX) U21.32(VSU33) U21.46(VSUS33) U21.49(VCCA33SSM) U21.57(VCCA33SS12) U21.66(VCCA33SS12) U24.2(VCC) U24.24(VCC) U24.39(VCC) U24.41(VCC) U24.52(VCC) U26.11(VCC) U27.3 U28.8(VCC) U32.2(VCC) U34.5(VIO)
PWR_3V4: C36.2 C37.2 C38.2 C39.2 C40.2 C41.2 U25.2(VCC) U25.24(VCC) U25.39(VCC) U25.41(VCC) U25.52(VCC)
PWR_5V: C74.2 C75.2 C86.2 C87.2 U22.18(+5V) U34.3(VCC)
VDD_EXT: R35.1 U25.11(VDD_EXT)
1PPS: U24.19(WAKEUP_IN) U28.4(1PPS)
4G_ANT: U20.1(ANT)
4G_LIG: R21.2 U27.4
4G_RESET: R17.1
433_ANT: U26.13(ANT)
433_LIG: R40.1 U27.5
433_RXEN: U26.9(RX_EN)
433_TXEN: U26.8(TX_EN)
ETH_LED_G: U16.12
ETH_LED_Y: U16.13
GPS_ANT: L4.2 R55.2
GPS_RESET: R58.1
HDMI0_CEC: U22.13(CEC)
HDMI0_CLK_N: U22.12(TMDSClock)
HDMI0_CLK_P: U22.10(TMDSClock)
HDMI0_HOT: U22.19(HotPlugDetect)
HDMI0_SCL: U22.15(SCL)
HDMI0_SDA: U22.16(SDA)
HDMI0_TX0_N: U22.9(TMDSData0-)
HDMI0_TX0_P: U22.7(TMDSData0+)
HDMI0_TX1_N: U22.6(TMDSData1-)
HDMI0_TX1_P: U22.4(TMDSData1+)
HDMI0_TX2_N: U22.3(TMDSData2-)
HDMI0_TX2_P: U22.1(TMDSData2+)
LORA_ANT: U17.1(ANT)
LORA_LIG: R36.2 U27.1
LORA_RESET: R19.1
PCIE_CLK_N: U21.22(PEXCLK-)
PCIE_CLK_P: U21.21(PEXCLK+)
PCIE_REQ: R37.1 U21.30(PEXCREQ#)
PCIE_RST: C73.2 U21.19(PEXRST#)
PCIE_RX_N: C71.2
PCIE_RX_P: C72.2
PCIE_TX_N: U21.28(PEXRX-)
PCIE_TX_P: U21.27(PEXRX+)
PEXTX_N: C71.1 U21.25(PEXTX-)
PEXTX_P: C72.1 U21.24(PEXTX+)
PONRST: C70.1 D4.2(A) R29.1 U21.31(PONRST#)
RS485_CTL: R54.2 U29.2(~{RE}) U29.3(DE)
SPI0_433: U26.7(CSN)
SPI0_LORA: U24.51(RESERVED7)
SPI0_MISO: U24.47(RESERVED5) U26.4(MISO)
SPI0_MOSI: U24.49(RESERVED6) U26.2(MOSI)
SPI0_SCK: U24.45(RESERVED4) U26.3(SCK)
SSRX1_N: U21.56(SSRX1-)
SSRX1_P: U21.55(SSRX1+)
SSRX2_N: U21.65(SSRX2-)
SSRX2_P: U21.64(SSRX2+)
SSTX1_N: U21.53(SSTX1-)
SSTX1_P: U21.52(SSTX1+)
SSTX2_N: U21.62(SSTX2-)
SSTX2_P: U21.61(SSTX2+)
SSXI: C56.2 U18.1(XI) U21.47(SSXI)
SSXO: C57.1 U18.3(XO) U21.48(SSXO)
TRD0_N: U16.3(MDI0-)
TRD0_P: U16.2(MDI0+)
TRD1_N: U16.7(MDI1-)
TRD1_P: U16.4(MDI1+)
TRD2_N: U16.6(MDI2-)
TRD2_P: U16.5(MDI2+)
TRD3_N: U16.9(MDI3-)
TRD3_P: U16.8(MDI3+)
UART0_RXD: U32.10(P1.5)
UART0_TXD: U32.11(P1.4)
UART2_RXD: R44.1
UART2_TXD: R47.1
UART3_RXD: R42.1
UART3_TXD: R48.1
UART5_RXD: R62.1
UART5_TXD: R60.1
USB2D1_N: U21.59(USB2D1-)
USB2D1_P: U21.58(USB2D1+)
USB2D2_N: U21.68(USB2D2-)
USB2D2_P: U21.67(USB2D2+)
USB2D3_N: R22.1 U21.8(USB2D3-)
USB2D3_P: R28.2 U21.7(USB2D3+)
USIM_CD: R35.2 U19.CD U23.1(CATHODE) U25.44(USIM_DET)
USIM_CLK: C69.2 R32.2 U19.C3(CLK) U23.4(CATHODE)
USIM_DATA: C68.2 R30.2 U19.C7(I/O) U23.5(CATHODE)
USIM_RST: C67.2 R33.2 U19.C2(RST) U23.6(CATHODE)
USIM_VDD: C66.2 U19.C1(VCC) U23.3(CATHODE) U25.8(USIM_VDD)
ZIGBEE_ANT: U33.1(ANT)
ZIGBEE_LIG: R45.2 R46.2 U27.7
ZIGBEE_RESET: R56.2 R57.2
ZIGBEE_SW: U32.6(P1.7)
NetC35_2: C35.2 U16.1(MCT)
NetC78_1: C78.1 C79.1 R43.1 U29.8(VCC)
NetC88_2: C88.2 R63.1 R64.1
NetL4_1: L4.1 R52.2
NetQ1_1: Q1.1(B) R17.2 R18.2
NetQ1_3: Q1.3(C) U25.22(PESRT1#)
NetQ2_1: Q2.1(B) R58.2 R59.2
NetQ2_3: Q2.3(C) U28.9(RESET)
NetR19_2: R19.2 U24.22(PESRT1#)
NetR20_2: R20.2 U16.11
NetR21_1: R21.1 U25.42(LED_WWAN#)
NetR22_2: R22.2 U25.36(USB_DM)
NetR23_2: R23.2 U16.14
NetR24_1: R24.1 U21.43(USBHOC1#)
NetR24_2: R24.2 R25.2 R26.2 R27.2
NetR25_1: R25.1 U21.41(USBHOC2#)
NetR26_1: R26.1 U21.39(USBHOC3#)
NetR27_1: R27.1 U21.37(USBHOC4#)
NetR28_1: R28.1 U25.38(USB_DP)
NetR30_1: R30.1 U25.10(USIM_DATA)
NetR31_1: R31.1 U21.50(SSREXT)
NetR32_1: R32.1 U25.12(USIM_CLK)
NetR33_1: R33.1 U25.14(USIM_RST)
NetR34_1: R34.1 U21.51(TESTEN)
NetR36_1: R36.1 U24.3(MIC_N)
NetR38_1: R38.1 U21.20(PEXWAKE#)
NetR39_1: R39.1 U21.18(SMI#)
NetR40_2: R40.2 U26.6(GD00)
NetR41_1: R41.1 U28.18(TIMER)
NetR42_2: R42.2 U29.1(RO)
NetR44_2: R44.2 U28.2(TXD1)
NetR45_1: R45.1 U32.12(P1.3)
NetR46_1: R46.1 U32.13(P1.2)
NetR47_2: R47.2 U28.3(RXD1)
NetR48_2: R48.2 U29.4(DI)
NetR49_2: R49.2 U28.5(STANDBY)
NetR50_1: R50.1 U29.7(B) U30.1(B) U31.2
NetR50_2: R50.2 R51.2 U29.6(A) U30.2(A) U31.1
NetR52_1: R52.1 U28.14(VCC_RF)
NetR53_2: R53.2 U28.6(V_BCKP)
NetR55_1: R55.1 U28.11(RF_IN)
NetR57_1: R57.1 U32.24(RESET)
NetR60_2: R60.2 U34.1(TXD)
NetR61_1: R61.1 U34.8(STB)
NetR62_2: R62.2 U34.4(RXD)
NetR63_2: R63.2 U34.7(CANH) U35.1(B) U36.2
NetR64_2: R64.2 U34.6(CANL) U35.2(A) U36.1

Not connected (* = marked no-connect by the designer): U19 C6(VPP)*; U21 1(SSTX3+)* 2(SSTX3-)* 4(SSRX3+)* 5(SSRX3-)* 10(SSTX4+)* 11(SSTX4-)* 13(SSRX4+)* 14(SSRX4-)* 16(USB2D4+)* 17(USB2D4-)* 26(NC)* 33(SPISO)* 34(SPICS#)* 35(SPICK)* 36(SPISI)* 38(USBHPE4#)* 40(USBHPE3#)* 42(USBHPE2#)* 44(USBHPE1#)*; U22 14(Reserved)*; U24 1(MIC_P)* 5(SPK_P)* 6(NC1)* 7(SPK_N)* 8(USIM_VDD)* 10(USIM_DATA)* 11(VDD_EXT)* 12(USIM_CLK)* 13(RESERVED1)* 14(USIM_RST)* 16(RESERVED2)* 17(RESERVED3)* 20(W_DISABLE#)* 23(UART_RXD)* 25(UART_RTS)* 28(UART_CTS)* 30(UART_DCD)* 31(UART_TXD)* 32(WAKEUP_OUT)* 33(PESRT2#)* 36(USB_DM)* 38(USB_DP)* 42(LED_WWAN#)* 44(USIM_DET)* 46(UART_DTR)* 48(NC2)*; U25 1(MIC_P)* 3(MIC_N)* 5(SPK_P)* 6(NC1)* 7(SPK_N)* 13(RESERVED1)* 16(RESERVED2)* 17(RESERVED3)* 19(WAKEUP_IN)* 20(W_DISABLE#)* 23(UART_RXD)* 25(UART_RTS)* 28(UART_CTS)* 30(UART_DCD)* 31(UART_TXD)* 32(WAKEUP_OUT)* 33(PESRT2#) 45(RESERVED4)* 46(UART_DTR)* 47(RESERVED5)* 48(NC2)* 49(RESERVED6)* 51(RESERVED7)*; U26 5(GD02)* 10(NC)*; U28 7(RSVD/NC)* 13(ANTON)* 15(RSVD/NC)* 16(RSVD/NC)* 17(RSVD/NC)*; U32 3(P2.2)* 4(P2.1)* 5(P2.0)* 7(P1.6)* 8(NC)* 9(NC)* 14(P1.1)* 15(P1.0)* 16(P0.7)* 17(P0.6)* 18(P0.5)* 19(P0.4)* 20(P0.3)* 21(P0.2)* 22(P0.1)* 23(P0.0)*

### Layout directives
differential pair: PEXTX_N, PEXTX_P, SSRX1_N, SSRX1_P, SSRX2_N, SSRX2_P, SSTX1_N, SSTX1_P, SSTX2_N, SSTX2_P, USB2D1_N, USB2D1_P, USB2D2_N, USB2D2_P

### Notes on the sheet
- 高电平点亮
  高电平复位。
- (near U16) ETH, NO LIG, NO RES, OK
- 低电平点亮
  高电平复位
- LORA SPI0 CS0, LIG, RES, OK
- 低电平点亮
- HDMI0, NO LIG, NO RES, OK
- PCIE, NO LIG, NO RES, OK
- 433 SPI0 CS1, LIG, NO RES, OK
- RS485 UART3, NO LIG, NO RES, OK
- 高电平点亮
  高电平复位
- GPS, OK
- CAN UART5, NO LIG, NO RES, OK
- 低电平点亮
  低电平复位
- ZIGBEE UART0, OK
- (in symbol HR911130A) GREEN; YELLOW

### Library data of the parts
C35 C54 = 0402 10nF (103) 10% 50V: 贴片电容; ComponentLink1Description: 供应商链接; ComponentLink1URL: http://www.szlcsc.com/product/details_15869.html; Package: 0402; Supplier: LC; SuppliersPartNumber: C15195
C36 C50 = 3528 100uF (107) 10% 6.3V: 钽电容; ComponentLink1Description: 供应商链接; ComponentLink1URL: http://www.szlcsc.com/product/details_16815.html; Package: 3528; Supplier: LC; SuppliersPartNumber: C16133
C37 C38 = 1206 100nF (104) 10% 50V: 贴片电容; ComponentLink1Description: 供应商链接; ComponentLink1URL: http://www.szlcsc.com/product/details_25237.html; Package: 1206; Supplier: LC; SuppliersPartNumber: C24497
C39-C41 = 1206 10uF (106) 10% 50V: 贴片电容; ComponentLink1Description: 供应商链接; ComponentLink1URL: http://www.szlcsc.com/product/details_14236.html; Package: 1206; Supplier: LC; SuppliersPartNumber: C13585
C42-C49 C52 C53 C58-C66 C71 C72 C74 C77 C81 C83 C84 C86 C88 = 0402 100nF (104) 10% 16V: 贴片电容; ComponentLink1Description: 供应商链接; ComponentLink1URL: http://www.szlcsc.com/product/details_1877.html; Package: 0402; Supplier: LC; SuppliersPartNumber: C1525
C51 C73 C75 C76 C79 C80 C82 C85 C87 = 0402 10uF (106) 20% 6.3V: 贴片电容; ComponentLink1Description: 供应商链接; ComponentLink1URL: http://www.szlcsc.com/product/details_16204.html; Package: 0402; Supplier: LC; SuppliersPartNumber: C15525
C55 = 0402 100pF (101) 5% 50V: 贴片电容; ComponentLink1Description: 供应商链接; ComponentLink1URL: http://www.szlcsc.com/product/details_1898.html; Package: 0402; Supplier: LC; SuppliersPartNumber: C1546
C56 C57 = 0402 18pF (180) 5% 50V: 贴片电容; ComponentLink1Description: 供应商链接; ComponentLink1URL: http://www.szlcsc.com/product/details_1901.html; Package: 0402; Supplier: LC; SuppliersPartNumber: C1549
C67-C69 = 0402 33pF (330) 5% 50V: 贴片电容; ComponentLink1Description: 供应商链接; ComponentLink1URL: http://www.szlcsc.com/product/details_1914.html; Package: 0402; Supplier: LC; SuppliersPartNumber: C1562
C70 C78 = 0402 1.0uF (105) 10% 25V: 贴片电容; ComponentLink1Description: 供应商链接; ComponentLink1URL: http://www.szlcsc.com/product/details_53938.html; Package: 0402; Supplier: LC; SuppliersPartNumber: C52923
L4 = 0603 47nH: 贴片电感; ComponentLink1Description: 供应商链接; ComponentLink1URL: http://www.szlcsc.com/product/details_30437.html; Package: 0603; Supplier: LC; SuppliersPartNumber: C29683
Q1 Q2 = NPN3904: Bipolar _BJT_ Transistor NPN 40V 200mA 300MHz 300mW Surface Mount SOT-23-3 _TO-236_; MF: ON Semiconductor; MP: MMBT3904LT1G; Value: *; Package: SOT-23-3 NXP Semiconductors; SnapEDA_Link: https://www.snapeda.com/parts/MMBT3904LT1G/ON%20Semiconductor/view-part/587490/?ref=snap; Price: None; Availability: Unavailable
R17 R34 R58 R61 = 0402 4.7KΩ (4701) 1%: 贴片电阻; ComponentLink1Description: 供应商链接; ComponentLink1URL: http://www.szlcsc.com/product/details_26643.html; Package: 0402; Supplier: LC; SuppliersPartNumber: C25900
R18 R59 = 0402 47KΩ (4702) 1%: 贴片电阻; ComponentLink1Description: 供应商链接; ComponentLink1URL: http://www.szlcsc.com/product/details_26535.html; Package: 0402; Supplier: LC; SuppliersPartNumber: C25792
R19 R22 R28 R43-R47 R55 R57 R60 R62 = 0402 0Ω (0R0) 1%: 贴片电阻; ComponentLink1Description: 供应商链接; ComponentLink1URL: http://www.szlcsc.com/product/details_17853.html; Package: 0402; Supplier: LC; SuppliersPartNumber: C17168
R20 R23 R36 = 0402 470Ω (4700) 1%: 贴片电阻; ComponentLink1Description: 供应商链接; ComponentLink1URL: http://www.szlcsc.com/product/details_25860.html; Package: 0402; Supplier: LC; SuppliersPartNumber: C25117
R21 R40 R53 = 0402 1KΩ (1001) 1%: 贴片电阻; ComponentLink1Description: 供应商链接; ComponentLink1URL: http://www.szlcsc.com/product/details_12256.html; Package: 0402; Supplier: LC; SuppliersPartNumber: C11702
R24-R27 R29 R37-R39 R41 R49 R51 R54 R56 = 0402 10KΩ (1002) 1%: 贴片电阻; ComponentLink1Description: 供应商链接; ComponentLink1URL: http://www.szlcsc.com/product/details_26487.html; Package: 0402; Supplier: LC; SuppliersPartNumber: C25744
R30 R32 R33 R42 R48 R63 R64 = 0402 22Ω (22R0) 1%: 贴片电阻; ComponentLink1Description: 供应商链接; ComponentLink1URL: http://www.szlcsc.com/product/details_25835.html; Package: 0402; Supplier: LC; SuppliersPartNumber: C25092
R31 = 0402 5.6KΩ (5601) 1%: 贴片电阻; ComponentLink1Description: 供应商链接; ComponentLink1URL: http://www.szlcsc.com/product/details_26651.html; Package: 0402; Supplier: LC; SuppliersPartNumber: C25908
R35 = 0402 51KΩ (5102) 1%: 贴片电阻; ComponentLink1Description: 供应商链接; ComponentLink1URL: http://www.szlcsc.com/product/details_26537.html; Package: 0402; Supplier: LC; SuppliersPartNumber: C25794
R50 = 0402 120Ω (1200) 1%: 贴片电阻; ComponentLink1Description: 供应商链接; ComponentLink1URL: http://www.szlcsc.com/product/details_25822.html; Package: 0402; Supplier: LC; SuppliersPartNumber: C25079
R52 = 0402 10Ω (10R0) 1%: 贴片电阻; ComponentLink1Description: 供应商链接; ComponentLink1URL: http://www.szlcsc.com/product/details_25820.html; Package: 0402; Supplier: LC; SuppliersPartNumber: C25077
U16 = HR911130A: RJ45
U17 U20 U33 = ANT-IPEX: ANT
U18 = OSC-25MHz: Passive crystal oscillator
U19 = NANO_SIM: 4G Card Slot
U21 = VL805: PCIe to USB3.0
U24 U25 = MINI_PCIE: LoRa, 4G
U26 = CC1101: 433Mhz
U27 = LED_4P: LED
U28 = L76K: GPS BEIDOU
U29 = MAX3485: UART = RS485
U30 U35 = Connector_2P: Connector for RS485, CAN
U32 = CC2530: ZigBee 2.4GHz
U34 = TJA1042T/3: UART = CAN

## Nets that join several sheets
GND: G1-CM4 (76 pins), G2-PMS (51 pins), G3-Sensor (143 pins)
PWR_1V05: G2-PMS (5 pins), G3-Sensor (16 pins)
PWR_3V3: G1-CM4 (R2.1 R3.1), G2-PMS (10 pins), G3-Sensor (52 pins)
PWR_3V4: G2-PMS (6 pins), G3-Sensor (11 pins)
PWR_5V: G1-CM4 (10 pins), G2-PMS (14 pins), G3-Sensor (6 pins)
1PPS: G1-CM4 (R1.1), G3-Sensor (U24.19 U28.4)
4G_ANT: G1-CM4 (U4.1), G3-Sensor (U20.1)
4G_RESET: G1-CM4 (U9.25), G3-Sensor (R17.1)
433_ANT: G1-CM4 (U6.1), G3-Sensor (U26.13)
433_RXEN: G1-CM4 (U9.47), G3-Sensor (U26.9)
433_TXEN: G1-CM4 (U9.45), G3-Sensor (U26.8)
ETH_LED_G: G1-CM4 (U9.15), G3-Sensor (U16.12)
ETH_LED_Y: G1-CM4 (U9.17), G3-Sensor (U16.13)
GPS_ANT: G1-CM4 (U7.1), G3-Sensor (L4.2 R55.2)
GPS_RESET: G1-CM4 (U9.29), G3-Sensor (R58.1)
HDMI0_CEC: G1-CM4 (U9.151), G3-Sensor (U22.13)
HDMI0_CLK_N: G1-CM4 (U9.190), G3-Sensor (U22.12)
HDMI0_CLK_P: G1-CM4 (U9.188), G3-Sensor (U22.10)
HDMI0_HOT: G1-CM4 (U9.153), G3-Sensor (U22.19)
HDMI0_SCL: G1-CM4 (U9.200), G3-Sensor (U22.15)
HDMI0_SDA: G1-CM4 (U9.199), G3-Sensor (U22.16)
HDMI0_TX0_N: G1-CM4 (U9.184), G3-Sensor (U22.9)
HDMI0_TX0_P: G1-CM4 (U9.182), G3-Sensor (U22.7)
HDMI0_TX1_N: G1-CM4 (U9.178), G3-Sensor (U22.6)
HDMI0_TX1_P: G1-CM4 (U9.176), G3-Sensor (U22.4)
HDMI0_TX2_N: G1-CM4 (U9.172), G3-Sensor (U22.3)
HDMI0_TX2_P: G1-CM4 (U9.170), G3-Sensor (U22.1)
LORA_ANT: G1-CM4 (U3.1), G3-Sensor (U17.1)
LORA_RESET: G1-CM4 (U9.27), G3-Sensor (R19.1)
PCIE_CLK_N: G1-CM4 (U9.112), G3-Sensor (U21.22)
PCIE_CLK_P: G1-CM4 (U9.110), G3-Sensor (U21.21)
PCIE_REQ: G1-CM4 (U9.102), G3-Sensor (R37.1 U21.30)
PCIE_RST: G1-CM4 (U9.109), G3-Sensor (C73.2 U21.19)
PCIE_RX_N: G1-CM4 (U9.118), G3-Sensor (C71.2)
PCIE_RX_P: G1-CM4 (U9.116), G3-Sensor (C72.2)
PCIE_TX_N: G1-CM4 (U9.124), G3-Sensor (U21.28)
PCIE_TX_P: G1-CM4 (U9.122), G3-Sensor (U21.27)
RS485_CTL: G1-CM4 (U9.56), G3-Sensor (R54.2 U29.2 U29.3)
SPI0_433: G1-CM4 (U9.37), G3-Sensor (U26.7)
SPI0_LORA: G1-CM4 (U9.39), G3-Sensor (U24.51)
SPI0_MISO: G1-CM4 (U9.40), G3-Sensor (U24.47 U26.4)
SPI0_MOSI: G1-CM4 (U9.44), G3-Sensor (U24.49 U26.2)
SPI0_SCK: G1-CM4 (U9.38), G3-Sensor (U24.45 U26.3)
SSRX1_N: G1-CM4 (U40.1), G3-Sensor (U21.56)
SSRX1_P: G1-CM4 (U40.2), G3-Sensor (U21.55)
SSRX2_N: G1-CM4 (U42.1), G3-Sensor (U21.65)
SSRX2_P: G1-CM4 (U42.2), G3-Sensor (U21.64)
SSTX1_N: G1-CM4 (C89.1), G3-Sensor (U21.53)
SSTX1_P: G1-CM4 (C90.1), G3-Sensor (U21.52)
SSTX2_N: G1-CM4 (C91.1), G3-Sensor (U21.62)
SSTX2_P: G1-CM4 (C92.1), G3-Sensor (U21.61)
TRD0_N: G1-CM4 (U9.10), G3-Sensor (U16.3)
TRD0_P: G1-CM4 (U9.12), G3-Sensor (U16.2)
TRD1_N: G1-CM4 (U9.6), G3-Sensor (U16.7)
TRD1_P: G1-CM4 (U9.4), G3-Sensor (U16.4)
TRD2_N: G1-CM4 (U9.9), G3-Sensor (U16.6)
TRD2_P: G1-CM4 (U9.11), G3-Sensor (U16.5)
TRD3_N: G1-CM4 (U9.5), G3-Sensor (U16.9)
TRD3_P: G1-CM4 (U9.3), G3-Sensor (U16.8)
UART0_RXD: G1-CM4 (U9.51), G3-Sensor (U32.10)
UART0_TXD: G1-CM4 (U9.55), G3-Sensor (U32.11)
UART2_RXD: G1-CM4 (U9.35), G3-Sensor (R44.1)
UART2_TXD: G1-CM4 (U9.36), G3-Sensor (R47.1)
UART3_RXD: G1-CM4 (U9.34), G3-Sensor (R42.1)
UART3_TXD: G1-CM4 (U9.54), G3-Sensor (R48.1)
UART5_RXD: G1-CM4 (U9.28), G3-Sensor (R62.1)
UART5_TXD: G1-CM4 (U9.31), G3-Sensor (R60.1)
USB2D1_N: G1-CM4 (U38.2 U39.3), G3-Sensor (U21.59)
USB2D1_P: G1-CM4 (U38.3 U39.2), G3-Sensor (U21.58)
USB2D2_N: G1-CM4 (U38.11 U41.3), G3-Sensor (U21.68)
USB2D2_P: G1-CM4 (U38.12 U41.2), G3-Sensor (U21.67)
USB_N: G1-CM4 (U9.103), G2-PMS (U10.A7 U10.B7)
USB_P: G1-CM4 (U9.105), G2-PMS (U10.A6 U10.B6)
ZIGBEE_ANT: G1-CM4 (U5.1), G3-Sensor (U33.1)
ZIGBEE_RESET: G1-CM4 (U9.41), G3-Sensor (R56.2 R57.2)
ZIGBEE_SW: G1-CM4 (SW3.2), G3-Sensor (U32.6)